# EAGLE schematic sap_flux (EAGLE 7.2.0)
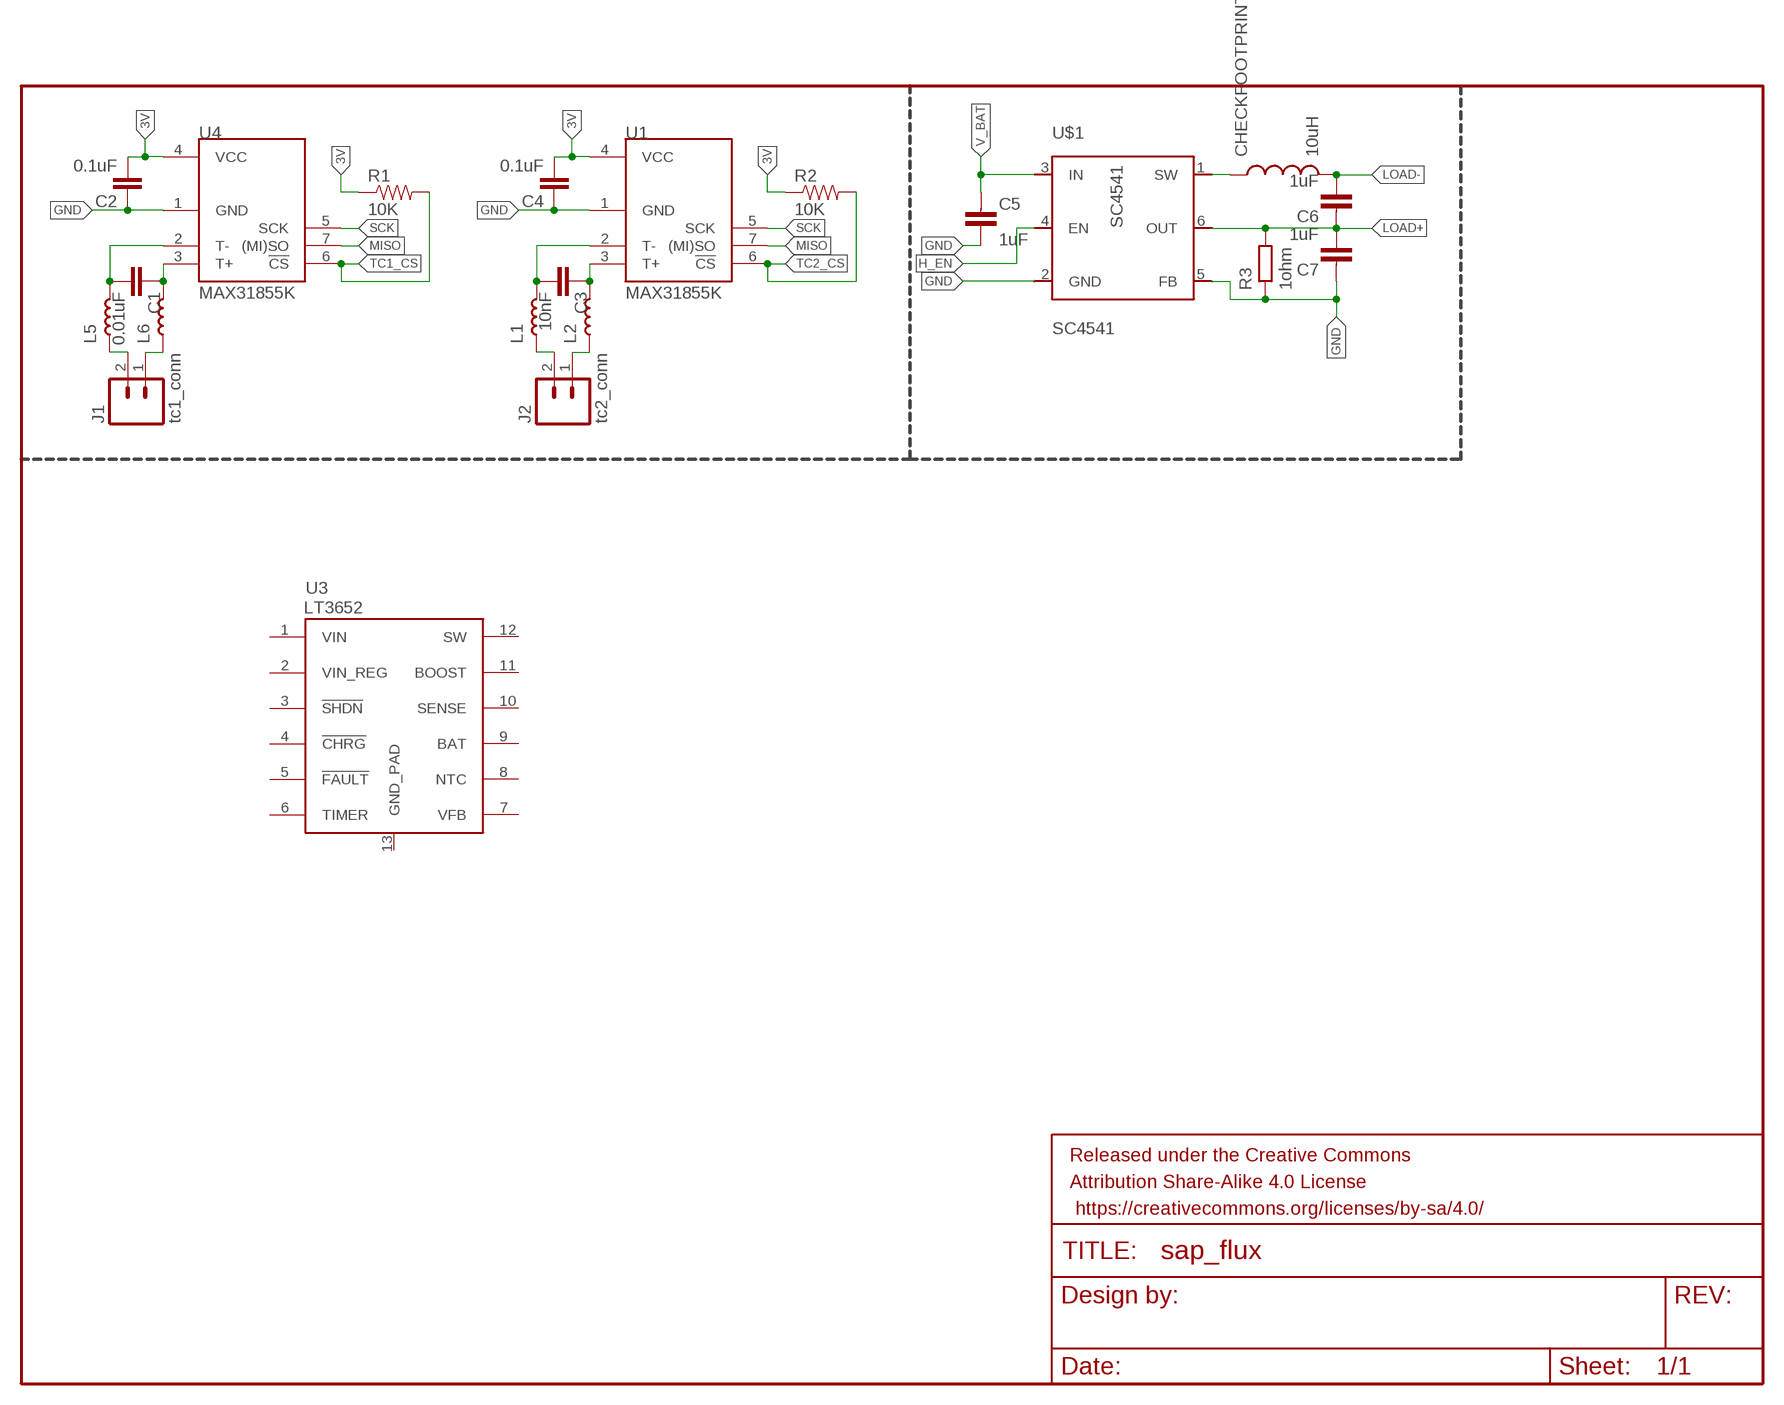
[diagram p0: schematic, sheet 1]

## Parts
C1  0.01uF  10NF/10000PF-50V-10%(0603)  [0603-CAP]
C2  0.1uF  0.1UF-25V(+80/-20%)(0603)  [0603-CAP]
C3  10nF  10NF/10000PF-50V-10%(0603)  [0603-CAP]
C4  0.1uF  0.1UF-25V(+80/-20%)(0603)  [0603-CAP]
C5  1uF  CAPACITOR0603-N  [C0603-N]
C6  1uF  CAPACITOR0603-N  [C0603-N]
C7  1uF  CAPACITOR0603-N  [C0603-N]
CHECKFOOTPRINT  10uH  INDUCTORSDR13-7-270ML  [INDUCTOR_SDR1307]
FRAME2  FRAME-LETTER  [CREATIVE_COMMONS]
J1  tc1_conn  M02PTH3  [1X02_LONGPADS]
J2  tc2_conn  M02PTH3  [1X02_LONGPADS]
L1  INDUCTOR0603-N  [L0603-N]
L2  INDUCTOR0603-N  [L0603-N]
L5  INDUCTOR0603-N  [L0603-N]
L6  INDUCTOR0603-N  [L0603-N]
R1  10K  10KOHM-1/10W-1%(0603)0603  [0603-RES]
R2  10K  10KOHM-1/10W-1%(0603)0603  [0603-RES]
R3  1ohm  RESISTOR0603-N  [R0603-N]
U1  MAX31855K  [SOIC8]
U3  LT3652  [MSOP-12_GND]
U4  MAX31855K  [SOIC8]
U$1  SC4541  [SOT23-6]

## Nets
3V: C2.2 C4.2 R1.1 R2.1 U1.4(VCC) U4.4(VCC)
GND: C2.1 C4.1 C5.2 C7.1 R3.1 U1.1(GND) U4.1(GND) U$1.2(GND) U$1.5(FB)
H_EN: U$1.4(EN)
LOAD+: C6.1 C7.2 R3.2 U$1.6(OUT)
LOAD-: C6.2 CHECKFOOTPRINT.P$2
MISO: U1.7((MI)SO) U4.7((MI)SO)
N$1: C3.2 L1.2 U1.2(T-)
N$2: C3.1 L2.2 U1.3(T+)
N$3: J2.1
N$4: J2.2
N$6: C1.2 L5.2 U4.2(T-)
N$7: C1.1 L6.2 U4.3(T+)
N$8: CHECKFOOTPRINT.P$1 U$1.1(SW)
N$9: J1.1
N$10: J1.2
SCK: U1.5(SCK) U4.5(SCK)
TC1_CS: R1.2 U4.6(!CS)
TC2_CS: R2.2 U1.6(!CS)
V_BAT: C5.1 U$1.3(IN)
Unconnected: L1.1 L2.1 L5.1 L6.1 U3.1(VIN) U3.2(VIN_REG) U3.3(!SHDN) U3.4(!CHRG) U3.5(!FAULT) U3.6(TIMER) U3.7(VFB) U3.8(NTC) U3.9(BAT) U3.10(SENSE) U3.11(BOOST) U3.12(SW) U3.13(GND_PAD)

## Library data of the parts
C1 = SparkFun_Thermocouple_Breakout:10NF/10000PF-50V-10%(0603): CAP-00867; PROD_ID: CAP-00867; VALUE: 10nF
C2 C4 = SparkFun_Thermocouple_Breakout:0.1UF-25V(+80/-20%)(0603): CAP-00810 Ceramic Standard decoupling cap; PROD_ID: CAP-00810
C3 = SparkFun_Thermocouple_Breakout:10NF/10000PF-50V-10%(0603): CAP-00867; PROD_ID: CAP-00867
C5-C7 = passives-7351:CAPACITOR
CHECKFOOTPRINT = SparkFun_Thermocouple_Breakout:INDUCTOR: Inductors Basic Inductor/Choke - 0603 and 1206. Footprints are not proven and vary greatly between part numbers. INDUCTOR POWER 3.3UH 4.0A SMD 0.197" L x 0.197" W x 0.177" H (5.00mm x 5.00mm x 4.50mm); PROD_ID: NDUC-12529; VALUE: 27uH
FRAME2 = SparkFun_Thermocouple_Breakout:FRAME-LETTER: Schematic Frame Standard 8.5x11 US Letter frame; DESIGNER: NAME; VERSION: v01
J1 J2 = SparkFun-Connectors:M02: Standard 2-pin 0.1" header. Use with - straight break away headers ( PRT-00116) - right angle break away headers (PRT-00553) - swiss pins (PRT-00743) - machine pins (PRT-00117) - female headers (PRT-00115) Molex polarized connector foot print use with: PRT-08233 with associated crimp pins and housings. 2.54_SCREWTERM for use with PRT-10571. 3.5mm Screw Terminal footprints for PRT-08084 5mm Screw Terminal footprints for use with PRT-08432
L1 L2 L5 L6 = passives-7351:INDUCTOR
R1 R2 = SparkFun_Thermocouple_Breakout:10KOHM-1/10W-1%(0603): RES-00824; PROD_ID: RES-00824
R3 = passives-7351:RESISTOR
U1 U4 = SparkFun_Thermocouple_Breakout:MAX31855K: Cold-Junction-Compensated K-Thermocoupleto-Digital Converter (-270°C to +1800°C) The MAX31855K performs cold-junction compensation and digitizes the signal from a type-K thermocouple. The data is output in a 14-bit resolution, SPI™-compatible, read-only format. This converter resolves temperatures to 0.25°C, allows readings as high as +1800°C and as low as -270°C, and exhibits thermocouple accuracy of ±2°C for temperatures ranging from -200°C to +700°C for K-type thermocouples.
U3 = SparkFun-PowerIC:LT3652: LT3652 MPPT Solar Charge Controller 5V-32V smart charger for batteries up to 14.4V
U$1 = _my-parts:SC4541